# EAGLE design led_matrix_cc (EAGLE 6.2)
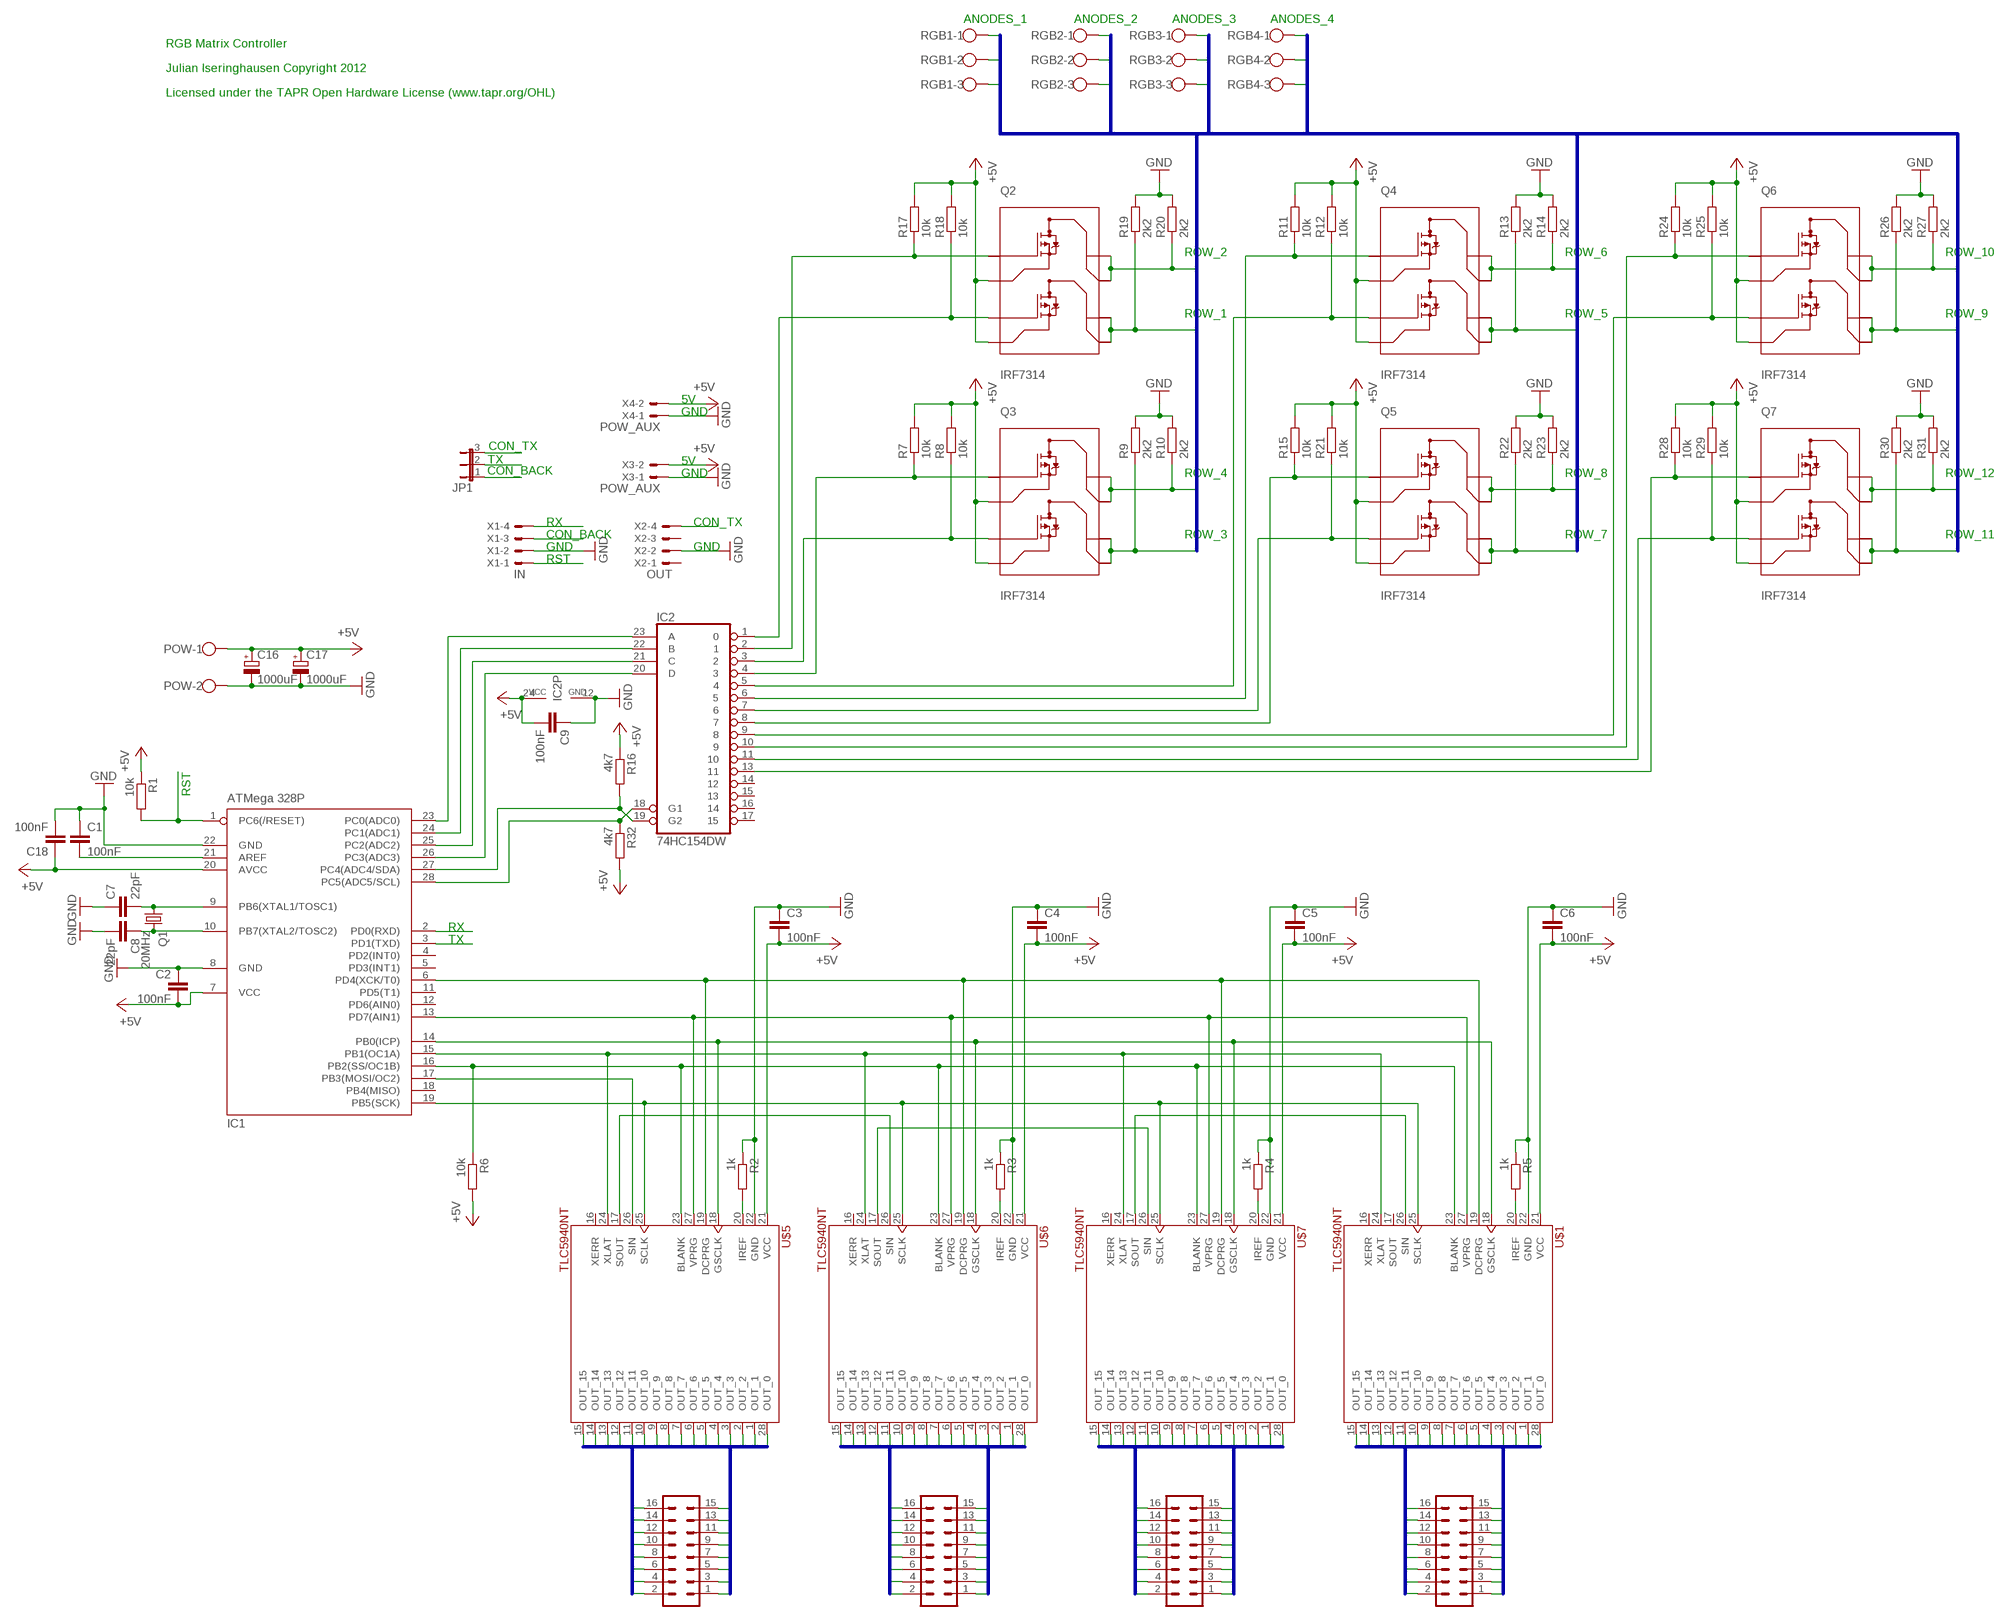
[diagram p0: schematic, sheet 1]

## Parts
C1  100nF  C-EUC1206  [C1206]
C2  100nF  C-EUC1206  [C1206]
C3  100nF  C-EUC1206  [C1206]
C4  100nF  C-EUC1206  [C1206]
C5  100nF  C-EUC1206  [C1206]
C6  100nF  C-EUC1206  [C1206]
C7  22pF  C-EUC1206  [C1206]
C8  22pF  C-EUC1206  [C1206]
C9  100nF  C-EUC1206  [C1206]
C16  1000uF  CPOL-EUE5-10.5  [E5-10,5]
C17  1000uF  CPOL-EUE5-10.5  [E5-10,5]
C18  100nF  C-EUC1206  [C1206]
CON_TLC_1  ML16  [ML16]
CON_TLC_2  ML16  [ML16]
CON_TLC_3  ML16  [ML16]
CON_TLC_4  ML16  [ML16]
IC1  ATMega 328P  MEGA8-P  [DIL28-3]
IC2  74HC154DW  [SO24W]
JP1  JP2E  [JP2]
POW  W237-102  [W237-102]
Q1  20MHz  CRYSTALHC49U70  [HC49U70]
Q2  IRF7314  TRANSISTOR-FET-MOD_IRF7389  [TRANSISTOR-FET-MOD_SO08-IRF]
Q3  IRF7314  TRANSISTOR-FET-MOD_IRF7389  [TRANSISTOR-FET-MOD_SO08-IRF]
Q4  IRF7314  TRANSISTOR-FET-MOD_IRF7389  [TRANSISTOR-FET-MOD_SO08-IRF]
Q5  IRF7314  TRANSISTOR-FET-MOD_IRF7389  [TRANSISTOR-FET-MOD_SO08-IRF]
Q6  IRF7314  TRANSISTOR-FET-MOD_IRF7389  [TRANSISTOR-FET-MOD_SO08-IRF]
Q7  IRF7314  TRANSISTOR-FET-MOD_IRF7389  [TRANSISTOR-FET-MOD_SO08-IRF]
R1  10k  R-EU_R1206  [R1206]
R2  1k  R-EU_R1206  [R1206]
R3  1k  R-EU_R1206  [R1206]
R4  1k  R-EU_R1206  [R1206]
R5  1k  R-EU_R1206  [R1206]
R6  10k  R-EU_R1206  [R1206]
R7  10k  RCL_R-EU_R1206  [RCL_R1206]
R8  10k  RCL_R-EU_R1206  [RCL_R1206]
R9  2k2  RCL_R-EU_R1206  [RCL_R1206]
R10  2k2  RCL_R-EU_R1206  [RCL_R1206]
R11  10k  RCL_R-EU_R1206  [RCL_R1206]
R12  10k  RCL_R-EU_R1206  [RCL_R1206]
R13  2k2  RCL_R-EU_R1206  [RCL_R1206]
R14  2k2  RCL_R-EU_R1206  [RCL_R1206]
R15  10k  RCL_R-EU_R1206  [RCL_R1206]
R16  4k7  R-EU_R1206  [R1206]
R17  10k  RCL_R-EU_R1206  [RCL_R1206]
R18  10k  RCL_R-EU_R1206  [RCL_R1206]
R19  2k2  RCL_R-EU_R1206  [RCL_R1206]
R20  2k2  RCL_R-EU_R1206  [RCL_R1206]
R21  10k  RCL_R-EU_R1206  [RCL_R1206]
R22  2k2  RCL_R-EU_R1206  [RCL_R1206]
R23  2k2  RCL_R-EU_R1206  [RCL_R1206]
R24  10k  RCL_R-EU_R1206  [RCL_R1206]
R25  10k  RCL_R-EU_R1206  [RCL_R1206]
R26  2k2  RCL_R-EU_R1206  [RCL_R1206]
R27  2k2  RCL_R-EU_R1206  [RCL_R1206]
R28  10k  RCL_R-EU_R1206  [RCL_R1206]
R29  10k  RCL_R-EU_R1206  [RCL_R1206]
R30  2k2  RCL_R-EU_R1206  [RCL_R1206]
R31  2k2  RCL_R-EU_R1206  [RCL_R1206]
R32  4k7  R-EU_R1206  [R1206]
RGB1  W237-103  [W237-103]
RGB2  W237-103  [W237-103]
RGB3  W237-103  [W237-103]
RGB4  W237-103  [W237-103]
U$1  TLC5940NT  TLC5940_TLC5940NT  [TLC5940_DIP-28]
U$5  TLC5940NT  TLC5940_TLC5940NT  [TLC5940_DIP-28]
U$6  TLC5940NT  TLC5940_TLC5940NT  [TLC5940_DIP-28]
U$7  TLC5940NT  TLC5940_TLC5940NT  [TLC5940_DIP-28]
X1  IN  22-23-2041  [22-23-2041]
X2  OUT  22-23-2041  [22-23-2041]
X3  POW_AUX  22-23-2021  [22-23-2021]
X4  POW_AUX  22-23-2021  [22-23-2021]

## Nets
+5V: C2.2 C3.2 C4.2 C5.2 C6.2 C9.2 C16.+ C17.+ C18.1 IC1.7(VCC) IC1.20(AVCC) IC2.24(VCC) POW.1 Q2.1(S1) Q2.3(S2) Q3.1(S1) Q3.3(S2) Q4.1(S1) Q4.3(S2) Q5.1(S1) Q5.3(S2) Q6.1(S1) Q6.3(S2) Q7.1(S1) Q7.3(S2) R1.1 R6.2 R7.2 R8.2 R11.2 R12.2 R15.2 R16.1 R17.2 R18.2 R21.2 R24.2 R25.2 R28.2 R29.2 R32.2 U$1.21(VCC) U$5.21(VCC) U$6.21(VCC) U$7.21(VCC) X3.2 X4.2
CON_BACK: JP1.1 X1.3
CON_TX: JP1.3 X2.4
GND: C1.1 C2.1 C3.1 C4.1 C5.1 C6.1 C7.1 C8.2 C9.1 C16.- C17.- C18.2 IC1.8(GND) IC1.22(GND) IC2.12(GND) POW.2 R2.1 R3.1 R4.1 R5.1 R9.2 R10.2 R13.2 R14.2 R19.2 R20.2 R22.2 R23.2 R26.2 R27.2 R30.2 R31.2 U$1.22(GND) U$5.22(GND) U$6.22(GND) U$7.22(GND) X1.2 X2.2 X3.1 X4.1
N$1: IC2.6 Q4.2(G1) R11.1
N$2: IC2.5 Q4.4(G2) R12.1
N$3: IC1.17(PB3(MOSI/OC2)) U$5.26(SIN)
N$4: U$5.17(SOUT) U$6.26(SIN)
N$5: U$6.17(SOUT) U$7.26(SIN)
N$6: IC1.19(PB5(SCK)) U$1.25(SCLK) U$5.25(SCLK) U$6.25(SCLK) U$7.25(SCLK)
N$7: IC1.16(PB2(SS/OC1B)) R6.1 U$1.23(BLANK) U$5.23(BLANK) U$6.23(BLANK) U$7.23(BLANK)
N$8: C7.2 IC1.9(PB6(XTAL1/TOSC1)) Q1.1
N$9: IC1.23(PC0(ADC0)) IC2.23(A)
N$10: IC1.24(PC1(ADC1)) IC2.22(B)
N$11: IC1.25(PC2(ADC2)) IC2.21(C)
N$12: IC1.26(PC3(ADC3)) IC2.20(D)
N$13: IC1.15(PB1(OC1A)) U$1.24(XLAT) U$5.24(XLAT) U$6.24(XLAT) U$7.24(XLAT)
N$14: IC1.6(PD4(XCK/T0)) U$1.19(DCPRG) U$5.19(DCPRG) U$6.19(DCPRG) U$7.19(DCPRG)
N$15: IC1.13(PD7(AIN1)) U$1.27(VPRG) U$5.27(VPRG) U$6.27(VPRG) U$7.27(VPRG)
N$16: IC1.14(PB0(ICP)) U$1.18(GSCLK) U$5.18(GSCLK) U$6.18(GSCLK) U$7.18(GSCLK)
N$17: U$1.26(SIN) U$7.17(SOUT)
N$18: R4.2 U$7.20(IREF)
N$19: IC1.28(PC5(ADC5/SCL)) IC2.18(G1) R32.1
N$20: IC2.9 Q6.4(G2) R25.1
N$21: R5.2 U$1.20(IREF)
N$22: IC2.8 Q5.2(G1) R15.1
N$24: IC2.10 Q6.2(G1) R24.1
N$25: R3.2 U$6.20(IREF)
N$27: R2.2 U$5.20(IREF)
N$29: IC2.13 Q7.2(G1) R28.1
N$31: C8.1 IC1.10(PB7(XTAL2/TOSC2)) Q1.2
N$32: IC2.1 Q2.4(G2) R18.1
N$33: IC2.2 Q2.2(G1) R17.1
N$34: IC2.4 Q3.2(G1) R7.1
N$35: IC2.3 Q3.4(G2) R8.1
N$36: IC2.11 Q7.4(G2) R29.1
N$37: IC2.7 Q5.4(G2) R21.1
N$38: C1.2 IC1.21(AREF)
N$39: IC1.27(PC4(ADC4/SDA)) IC2.19(G2) R16.2
ROW1: Q2.5(D2B) Q2.6(D2A) R19.1 RGB1.1
ROW2: Q2.7(D1B) Q2.8(D1A) R20.1 RGB1.2
ROW3: Q3.5(D2B) Q3.6(D2A) R9.1 RGB1.3
ROW4: Q3.7(D1B) Q3.8(D1A) R10.1 RGB2.1
ROW5: Q4.5(D2B) Q4.6(D2A) R13.1 RGB2.2
ROW6: Q4.7(D1B) Q4.8(D1A) R14.1 RGB2.3
ROW7: Q5.5(D2B) Q5.6(D2A) R22.1 RGB3.1
ROW8: Q5.7(D1B) Q5.8(D1A) R23.1 RGB3.2
ROW9: Q6.5(D2B) Q6.6(D2A) R26.1 RGB3.3
ROW10: Q6.7(D1B) Q6.8(D1A) R27.1 RGB4.1
ROW11: Q7.5(D2B) Q7.6(D2A) R30.1 RGB4.2
ROW12: Q7.7(D1B) Q7.8(D1A) R31.1 RGB4.3
RST: IC1.1(PC6(/RESET)) R1.2 X1.1
RX: IC1.2(PD0(RXD)) X1.4
T1_1: CON_TLC_1.1 U$5.28(OUT_0)
T1_2: CON_TLC_1.2 U$5.1(OUT_1)
T1_3: CON_TLC_1.3 U$5.2(OUT_2)
T1_4: CON_TLC_1.4 U$5.3(OUT_3)
T1_5: CON_TLC_1.5 U$5.4(OUT_4)
T1_6: CON_TLC_1.6 U$5.5(OUT_5)
T1_7: CON_TLC_1.7 U$5.6(OUT_6)
T1_8: CON_TLC_1.8 U$5.7(OUT_7)
T1_9: CON_TLC_1.9 U$5.8(OUT_8)
T1_10: CON_TLC_1.10 U$5.9(OUT_9)
T1_11: CON_TLC_1.11 U$5.10(OUT_10)
T1_12: CON_TLC_1.12 U$5.11(OUT_11)
T1_13: CON_TLC_1.13 U$5.12(OUT_12)
T1_14: CON_TLC_1.14 U$5.13(OUT_13)
T1_15: CON_TLC_1.15 U$5.14(OUT_14)
T1_16: CON_TLC_1.16 U$5.15(OUT_15)
T2_1: CON_TLC_2.1 U$6.28(OUT_0)
T2_2: CON_TLC_2.2 U$6.1(OUT_1)
T2_3: CON_TLC_2.3 U$6.2(OUT_2)
T2_4: CON_TLC_2.4 U$6.3(OUT_3)
T2_5: CON_TLC_2.5 U$6.4(OUT_4)
T2_6: CON_TLC_2.6 U$6.5(OUT_5)
T2_7: CON_TLC_2.7 U$6.6(OUT_6)
T2_8: CON_TLC_2.8 U$6.7(OUT_7)
T2_9: CON_TLC_2.9 U$6.8(OUT_8)
T2_10: CON_TLC_2.10 U$6.9(OUT_9)
T2_11: CON_TLC_2.11 U$6.10(OUT_10)
T2_12: CON_TLC_2.12 U$6.11(OUT_11)
T2_13: CON_TLC_2.13 U$6.12(OUT_12)
T2_14: CON_TLC_2.14 U$6.13(OUT_13)
T2_15: CON_TLC_2.15 U$6.14(OUT_14)
T2_16: CON_TLC_2.16 U$6.15(OUT_15)
T3_1: CON_TLC_3.1 U$7.28(OUT_0)
T3_2: CON_TLC_3.2 U$7.1(OUT_1)
T3_3: CON_TLC_3.3 U$7.2(OUT_2)
T3_4: CON_TLC_3.4 U$7.3(OUT_3)
T3_5: CON_TLC_3.5 U$7.4(OUT_4)
T3_6: CON_TLC_3.6 U$7.5(OUT_5)
T3_7: CON_TLC_3.7 U$7.6(OUT_6)
T3_8: CON_TLC_3.8 U$7.7(OUT_7)
T3_9: CON_TLC_3.9 U$7.8(OUT_8)
T3_10: CON_TLC_3.10 U$7.9(OUT_9)
T3_11: CON_TLC_3.11 U$7.10(OUT_10)
T3_12: CON_TLC_3.12 U$7.11(OUT_11)
T3_13: CON_TLC_3.13 U$7.12(OUT_12)
T3_14: CON_TLC_3.14 U$7.13(OUT_13)
T3_15: CON_TLC_3.15 U$7.14(OUT_14)
T3_16: CON_TLC_3.16 U$7.15(OUT_15)
T4_1: CON_TLC_4.1 U$1.28(OUT_0)
T4_2: CON_TLC_4.2 U$1.1(OUT_1)
T4_3: CON_TLC_4.3 U$1.2(OUT_2)
T4_4: CON_TLC_4.4 U$1.3(OUT_3)
T4_5: CON_TLC_4.5 U$1.4(OUT_4)
T4_6: CON_TLC_4.6 U$1.5(OUT_5)
T4_7: CON_TLC_4.7 U$1.6(OUT_6)
T4_8: CON_TLC_4.8 U$1.7(OUT_7)
T4_9: CON_TLC_4.9 U$1.8(OUT_8)
T4_10: CON_TLC_4.10 U$1.9(OUT_9)
T4_11: CON_TLC_4.11 U$1.10(OUT_10)
T4_12: CON_TLC_4.12 U$1.11(OUT_11)
T4_13: CON_TLC_4.13 U$1.12(OUT_12)
T4_14: CON_TLC_4.14 U$1.13(OUT_13)
T4_15: CON_TLC_4.15 U$1.14(OUT_14)
T4_16: CON_TLC_4.16 U$1.15(OUT_15)
TX: IC1.3(PD1(TXD)) JP1.2
Unconnected: IC1.4(PD2(INT0)) IC1.5(PD3(INT1)) IC1.11(PD5(T1)) IC1.12(PD6(AIN0)) IC1.18(PB4(MISO)) IC2.14 IC2.15 IC2.16 IC2.17 U$1.16(XERR) U$1.17(SOUT) U$5.16(XERR) U$6.16(XERR) U$7.16(XERR) X2.1 X2.3

## Buses
BUS_T1:T1_[1..16]
BUS_T2:T2_[1..16]
BUS_T3:T3_[1..16]
BUS_T4:T4_[1..16]
BUS_ROWS:ROW[1..12]

## Notes on the sheet
- ANODES_1 | ANODES_2 | ANODES_3 | ANODES_4
- RGB Matrix Controller
- Julian Iseringhausen Copyright 2012
- Licensed under the TAPR Open Hardware License (www.tapr.org/OHL)
- ROW_2 | ROW_6 | ROW_10
- ROW_1 | ROW_5 | ROW_9
- 5V
- GND
- CON_TX
- TX | 5V
- CON_BACK | GND | ROW_4 | ROW_8 | ROW_12
- RX | CON_TX
- CON_BACK | ROW_3 | ROW_7 | ROW_11
- GND | GND
- RST
- RST
- RX
- TX

## Library data of the parts
C1-C9 C18 = rcl:C-EU: CAPACITOR, European symbol
C16 C17 = rcl:CPOL-EU: POLARIZED CAPACITOR, European symbol
CON_TLC_1-CON_TLC_4 = con-harting-ml:ML16: HARTING; OC_FARNELL: unknown; OC_NEWARK: unknown
IC1 = atmel:MEGA8-P: MICROCONTROLLER 8 Kbytes FLASH, 1 kbytes SRAM, 512 bytes EEPROM, USART, 4-channel 10 bit ADC, 2-channel 8 bit ADC Pin compatible with Atmega48, ATMega88, ATMega168 Source: avr.lbr; OC_FARNELL: unknown; OC_NEWARK: unknown
IC2 = 74xx-eu:74*154: 4-line to 16-line data SELECTOR/MULTIPLEXER
JP1 = jumper:JP2E: JUMPER
POW = con-wago-500:W237-102: WAGO SCREW CLAMP; MPN: 237-102; OC_FARNELL: unknown; OC_NEWARK: 70K9898
Q1 = crystal:CRYSTAL: CRYSTAL; OC_FARNELL: unknown; OC_NEWARK: unknown
Q2-Q7 = TLC_5940_16x8:TRANSISTOR-FET-MOD_IRF7389: Complimentary Half Bridge HEXFET Power MOSFET Source: http://www.irf.com/product-info/datasheets/data/irf7389.pdf
R1-R6 R16 R32 = rcl:R-EU_: RESISTOR, European symbol
R7-R15 R17-R31 = TLC_5940_16x8:RCL_R-EU_: RESISTOR, European symbol
RGB1-RGB4 = con-wago-500:W237-103: WAGO SCREW CLAMP; MPN: 237-103; OC_FARNELL: unknown; OC_NEWARK: 18M7116
U$1 U$5-U$7 = TLC_5940_16x8:TLC5940_TLC5940
X1 X2 = con-molex:22-23-2041: .100" (2.54mm) Center Header - 4 Pin; MF: MOLEX; MPN: 22-23-2041; OC_FARNELL: 1462920; OC_NEWARK: 38C0355
X3 X4 = con-molex:22-23-2021: .100" (2.54mm) Center Header - 2 Pin; MF: MOLEX; MPN: 22-23-2021; OC_FARNELL: 1462926; OC_NEWARK: 25C3832

## Board
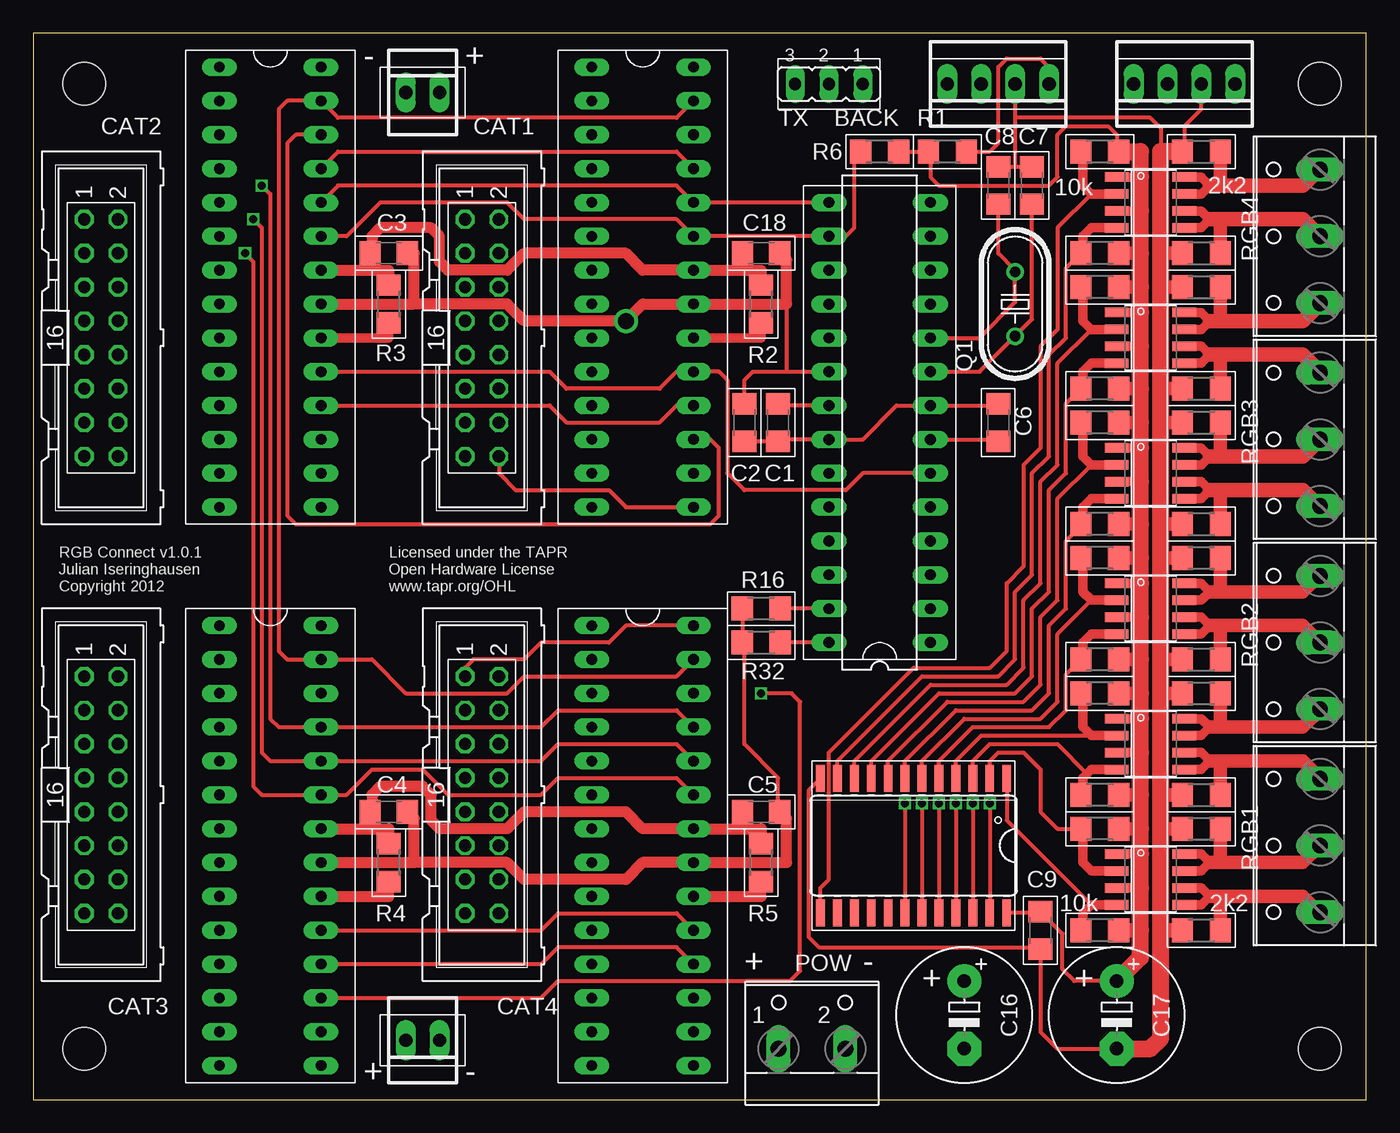
[diagram p1: board, top side]
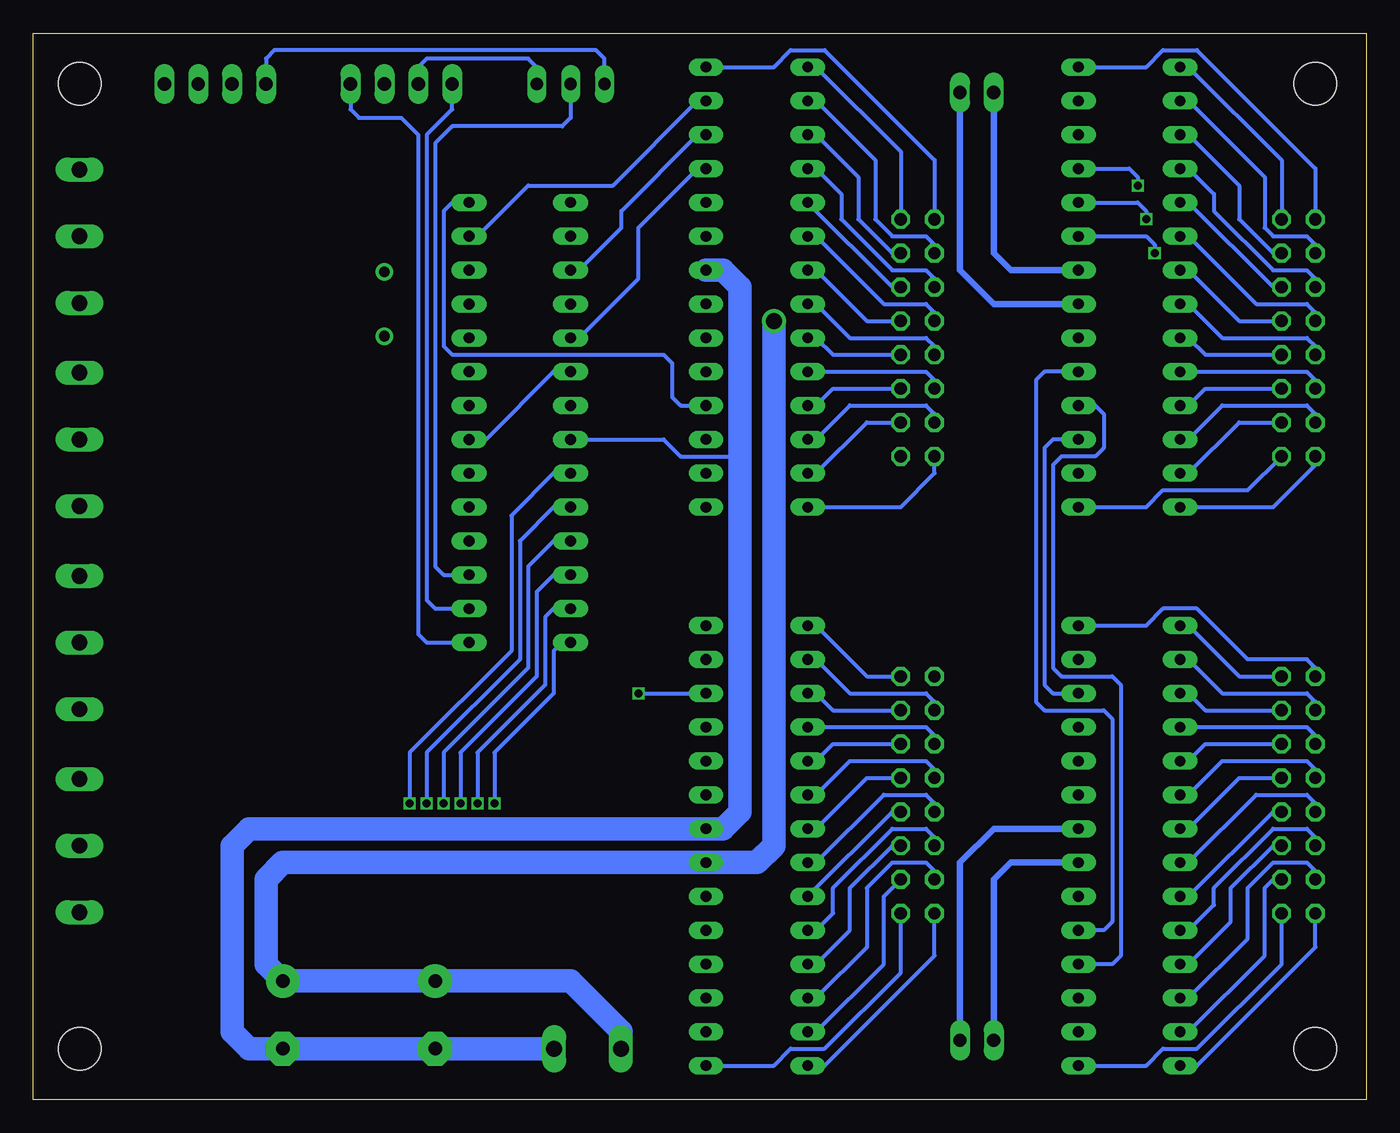
[diagram p2: board, bottom side, seen from below]

Size 100 x 80 mm. Coordinates in mm from the lower left corner, seen from the top.
Outline: 0,0 100,0 100,80 0,80 0,0
Copper layers (1*16): Top 0.035mm / dielectric 1.5mm / Bottom 0.035mm
Design rules: minimum track width 6mil, minimum drill 12mil, track to track 6mil, track to pad 6mil, pad to pad 6mil, via to via 6mil, smd to smd 0mil, copper to edge 10mil, drill to drill 10mil, minimum pad ring 10mil, minimum via ring 6mil, stop-mask expansion 2mil, vias tented up to drill 100mil, thermal gap 10mil
Holes 3.2 mm at 3.81,76.2 3.81,3.81 96.52,3.81 96.52,76.2

### Footprints (pad centres in the part's own frame; a part is rotated, then mirrored left to right if it is on the bottom)
C1206 = smd 1.6 x 1.8: 1 -1.4,0; 2 1.4,0
E5-10,5 = drill 1.016 pad 2.54: + -2.54,0 | drill 1.016 pad 2.54 octagon: - 2.54,0
ML16 = drill 0.914 octagon: 1 -8.89,-1.27; 2 -8.89,1.27; 3 -6.35,-1.27; 4 -6.35,1.27; 5 -3.81,-1.27; 6 -3.81,1.27; 7 -1.27,-1.27; 8 -1.27,1.27; 9 1.27,-1.27; 10 1.27,1.27; 11 3.81,-1.27; 12 3.81,1.27; 13 6.35,-1.27; 14 6.35,1.27; 15 8.89,-1.27; 16 8.89,1.27
DIL28-3 = drill 0.813 long: 1 -16.51,-3.81; 2 -13.97,-3.81; 3 -11.43,-3.81; 4 -8.89,-3.81; 5 -6.35,-3.81; 6 -3.81,-3.81; 7 -1.27,-3.81; 8 1.27,-3.81; 9 3.81,-3.81; 10 6.35,-3.81; 11 8.89,-3.81; 12 11.43,-3.81; 13 13.97,-3.81; 14 16.51,-3.81; 15 16.51,3.81; 16 13.97,3.81; 17 11.43,3.81; 18 8.89,3.81; 19 6.35,3.81; 20 3.81,3.81; 21 1.27,3.81; 22 -1.27,3.81; 23 -3.81,3.81; 24 -6.35,3.81; 25 -8.89,3.81; 26 -11.43,3.81; 27 -13.97,3.81; 28 -16.51,3.81
SO24W = smd 0.66 x 2.032: 1 -6.985,-5.029; 2 -5.715,-5.029; 3 -4.445,-5.029; 4 -3.175,-5.029; 5 -1.905,-5.029; 6 -0.635,-5.029; 7 0.635,-5.029; 8 1.905,-5.029; 9 3.175,-5.029; 10 4.445,-5.029; 11 5.715,-5.029; 12 6.985,-5.029; 13 6.985,5.029; 14 5.715,5.029; 15 4.445,5.029; 16 3.175,5.029; 17 1.905,5.029; 18 0.635,5.029; 19 -0.635,5.029; 20 -1.905,5.029; 21 -3.175,5.029; 22 -4.445,5.029; 23 -5.715,5.029; 24 -6.985,5.029
JP2 = drill 0.914 long: 1 -2.54,0; 2 0,0; 3 2.54,0
W237-102 = drill 1.194 long: 1 -2.5,-1.27; 2 2.5,-1.27
HC49U70 = drill 0.813: 1 -2.413,0; 2 2.413,0
TRANSISTOR-FET-MOD_SO08-IRF = smd 0.72 x 1.78: 1 -1.905,-2.543; 2 -0.635,-2.543; 3 0.635,-2.543; 4 1.905,-2.543; 5 1.905,2.543; 6 0.635,2.543; 7 -0.635,2.543; 8 -1.905,2.543
R1206 = smd 1.6 x 1.803: 1 -1.422,0; 2 1.422,0
RCL_R1206 = smd 1.6 x 1.803: 1 -1.422,0; 2 1.422,0
W237-103 = drill 1.194 long: 1 -5,-1.29; 2 0,-1.29; 3 5,-1.29
TLC5940_DIP-28 = drill 0.8 long: 1 -3.81,-1.27; 2 -3.81,-3.81; 3 -3.81,-6.35; 4 -3.81,-8.89; 5 -3.81,-11.43; 6 -3.81,-13.97; 7 -3.81,-16.51; 8 -3.81,-19.05; 9 -3.81,-21.59; 10 -3.81,-24.13; 11 -3.81,-26.67; 12 -3.81,-29.21; 13 -3.81,-31.75; 14 -3.81,-34.29; 15 3.81,-34.29; 16 3.81,-31.75; 17 3.81,-29.21; 18 3.81,-26.67; 19 3.81,-24.13; 20 3.81,-21.59; 21 3.81,-19.05; 22 3.81,-16.51; 23 3.81,-13.97; 24 3.81,-11.43; 25 3.81,-8.89; 26 3.81,-6.35; 27 3.81,-3.81; 28 3.81,-1.27
22-23-2041 = drill 1 long: 1 -3.81,0; 2 -1.27,0; 3 1.27,0; 4 3.81,0
22-23-2021 = drill 1 long: 1 -1.27,0; 2 1.27,0

### Placement (x,y rotation side)
C1  55.88,50.8 90 top
C2  53.34,50.8 90 top
C3  26.67,63.5 0 top
C4  26.67,21.59 0 top
C5  54.61,21.59 0 top
C6  72.39,50.8 270 top
C7  74.93,68.58 270 top
C8  72.39,68.58 90 top
C9  75.56,12.7 90 top
C16  69.85,6.35 270 top
C17  81.28,6.35 270 top
C18  54.61,63.5 180 top
CON_TLC_1  33.66,57.15 270 top
CON_TLC_2  5.08,57.15 270 top
CON_TLC_3  5.08,22.86 270 top
CON_TLC_4  33.66,22.86 270 top
IC1  63.5,50.8 90 top
IC2  66.04,19.05 180 top
JP1  59.69,76.2 180 top
POW  58.42,5.08 0 top
Q1  73.66,59.69 90 top
Q2  83.82,16.51 270 top
Q3  83.82,26.67 270 top
Q4  83.82,36.83 270 top
Q5  83.82,46.99 270 top
Q6  83.82,57.15 270 top
Q7  83.82,67.31 270 top
R1  68.58,71.12 0 top
R2  54.61,59.69 270 top
R3  26.67,59.69 270 top
R4  26.67,17.78 270 top
R5  54.61,17.78 270 top
R6  63.5,71.12 0 top
R7  80.01,30.48 0 top
R8  80.01,22.86 0 top
R9  87.63,22.86 180 top
R10  87.63,30.48 180 top
R11  80.01,40.64 0 top
R12  80.01,33.02 0 top
R13  87.63,33.02 180 top
R14  87.63,40.64 180 top
R15  80.01,50.8 0 top
R16  54.61,36.83 0 top
R17  80.01,20.32 0 top
R18  80.01,12.7 0 top
R19  87.63,12.7 180 top
R20  87.63,20.32 180 top
R21  80.01,43.18 0 top
R22  87.63,43.18 180 top
R23  87.63,50.8 180 top
R24  80.01,60.96 0 top
R25  80.01,53.34 0 top
R26  87.63,53.34 180 top
R27  87.63,60.96 180 top
R28  80.01,71.12 0 top
R29  80.01,63.5 0 top
R30  87.63,63.5 180 top
R31  87.63,71.12 180 top
R32  54.61,34.29 180 top
RGB1  95.25,19.05 90 top
RGB2  95.25,34.29 90 top
RGB3  95.25,49.53 90 top
RGB4  95.25,64.77 90 top
U$1  45.72,36.83 0 top
U$5  45.72,78.74 0 top
U$6  17.78,78.74 0 top
U$7  17.78,36.83 0 top
X1  72.39,76.2 180 top
X2  86.36,76.2 180 top
X3  29.21,4.45 180 top
X4  29.21,75.56 0 top

### Tracks (layer width: path | path; a pad name or v marks a point on that pad's centre or on a via)
+5V  (via drill 1.2 pad 1.27)
  Top 0.3: IC1.7 72.26,49.53 C6.2 | R16.1 R32.2 53.34,34.14 53.34,26.67 55.88,24.13 55.88,21.59 C5.2 | 56.52,59.69 56.52,54.61 | 56.52,54.61 IC1.20 | C2.2 53.34,53.98 53.98,54.61 56.52,54.61 | R6.2 R1.1 67.31,71.12 67.31,69.22 67.94,68.58 76.2,68.58 76.83,69.22 76.83,72.39 77.47,73.03 80.64,73.03 81.28,72.39 81.28,71.27 R28.2 | IC2.24 75.49,14.02 C9.2 77.22,12.45 77.22,9.78 78.11,8.89 C17.+
  Top 0.7: Q2.1 83.06,18.41 | Q2.3 83.06,15.88 | 28.57,63.5 C3.2 | 28.57,21.09 C4.2 | 56.52,62.99 C18.1
  Top 0.72: Q3.3 83.06,26.04 | Q3.1 83.06,28.57 | Q4.3 83.06,36.2 | Q4.1 83.06,38.73 | Q5.1 83.06,48.9 | Q5.3 83.06,46.35 | Q6.3 83.06,56.52 | Q6.1 83.06,59.05 | Q7.1 83.06,69.22 | Q7.3 83.06,66.67
  Top 0.813: U$6.21 28.57,59.69 | 28.57,59.69 28.57,63.5 | 28.57,59.69 35.56,59.69 36.83,58.42 v44.45,58.42 45.72,59.69 U$5.21 56.52,59.69 56.52,62.99 | U$7.21 28.57,17.78 | 28.57,17.78 28.57,21.09 | C5.2 56.52,21.09 56.52,17.78 U$1.21 45.72,17.78 44.45,16.51 36.83,16.51 35.56,17.78 28.57,17.78
  Top 1: R17.2 83.06,20.32 | R8.2 83.06,22.86 | R7.2 83.06,30.48 | R11.2 83.06,40.64 | R12.2 83.06,33.02 | R21.2 83.06,43.18 | R15.2 83.06,50.8 | R24.2 83.06,60.96 | R25.2 83.06,53.34 | R29.2 83.06,63.5
  Top 1.1: R18.2 83.06,12.7
  Top 1.27: C17.+ 83.06,10.67 83.06,12.7 83.06,15.88 83.06,18.41 83.06,20.32 83.06,22.86 83.06,26.04 83.06,28.57 83.06,30.48 83.06,33.02 83.06,36.2 83.06,38.73 83.06,40.64 83.06,43.18 83.06,46.35 83.06,48.9 83.06,50.8 83.06,53.34 83.06,56.52 83.06,59.05 83.06,60.96 83.06,63.5 83.06,66.67 83.06,69.22 83.06,71.12 R28.2
  Bottom 0.3: IC1.20 60.96,54.61 66.04,49.53 IC1.7
  Bottom 0.5: X3.2 27.94,16.51 26.67,17.78 U$7.21 | X4.2 30.48,62.23 27.94,59.69 U$6.21
  Bottom 1.778: POW.1 55.92,5.12 59.69,8.89 C16.+ C17.+ 82.55,10.16 82.55,16.51 81.28,17.78 U$1.21 45.72,17.78 44.45,19.05 v44.45,58.42
CON_BACK
  Bottom 0.3: JP1.1 62.23,77.47 62.87,78.11 70.48,78.11 71.12,77.47 X1.3
CON_TX
  Bottom 0.3: JP1.3 57.15,78.11 57.78,78.74 81.92,78.74 82.55,78.11 X2.4
GND
  Top 0.3: C8.2 73.66,69.98 | 73.66,69.98 C7.1 | C2.1 C1.1 56.01,49.53 IC1.22 62.23,49.53 64.77,52.07 IC1.8 72.26,52.07 C6.1 | R31.2 86.36,71.27 86.36,73.03 87.63,74.3 X2.2 | X1.2 73.66,73.66 | 73.66,73.66 73.66,69.98 | 73.66,73.66 83.82,73.66 84.58,72.9 84.58,71.25 84.71,71.12 | C17.- 76.83,3.81 75.56,5.08 C9.1 75.44,11.43 58.93,11.43 58.17,12.19 58.17,23.19 IC2.12 58.93,24.21 58.93,24.64
  Top 0.7: 25.4,63.63 C3.1 25.27,62.36 25.4,62.23 | 25.27,20.45 25.4,20.32 | 25.4,21.72 C4.1 | C18.2 53.21,62.36 53.34,62.23
  Top 0.813: 25.4,63.63 25.4,64.77 26.04,65.41 29.84,65.41 30.48,64.77 30.48,62.87 31.11,62.23 35.56,62.23 36.83,63.5 44.45,63.5 45.72,62.23 U$5.22 53.34,62.23 54.61,62.23 R2.1 | U$7.22 25.4,20.32 26.67,20.32 R4.1 | C4.1 25.27,20.45 | 53.34,20.32 U$1.22 45.72,20.32 44.45,21.59 36.83,21.59 35.56,20.32 30.48,20.32 29.84,20.95 29.84,22.86 29.21,23.5 26.04,23.5 25.4,22.86 25.4,21.72 | 53.34,20.32 54.61,20.32 R5.1 | U$6.22 25.4,62.23 26.67,62.23 R3.1 | C5.1 53.21,20.45 53.34,20.32
  Top 1: R20.2 84.58,20.32 | R9.2 84.58,22.86 | R10.2 84.58,30.48 | R13.2 84.58,33.02 | R14.2 84.58,40.64 | R22.2 84.58,43.18 | R23.2 84.58,50.8 | R27.2 84.58,60.96 | R30.2 84.58,63.5 | R26.2 84.58,53.34
  Top 1.1: R19.2 84.58,12.7 | 84.71,71.12 84.58,71.12
  Top 1.27: C17.- 83.82,3.81 84.58,4.57 84.58,12.7 84.58,20.32 84.58,22.86 84.58,30.48 84.58,33.02 84.58,40.64 84.58,43.18 84.58,50.8 84.58,53.34 84.58,60.96 84.58,63.5 84.58,71.12 | R31.2 84.71,71.12
  Bottom 0.3: IC1.22 52.7,49.53 51.44,48.26 46.99,48.26
  Bottom 0.5: X3.1 30.48,17.78 27.94,20.32 U$7.22 | X4.1 27.94,63.5 26.67,62.23 U$6.22
  Bottom 1.778: POW.2 C16.- C17.- 83.82,3.81 85.09,5.08 85.09,19.05 83.82,20.32 U$1.22 48.26,20.32 46.99,21.59 46.99,48.26 46.99,60.96 48.26,62.23 U$5.22
N$1
  Top 0.3: 79.38,37.47 76.83,34.92 76.83,29.84 75.56,28.57 69.85,28.57 66.67,25.4 IC2.6
  Top 0.7: 78.74,40.49 R11.1
  Top 0.72: Q4.2 79.38,37.47 78.74,38.1 78.74,40.49
N$2
  Top 0.3: IC2.5 67.94,25.4 70.48,27.94 76.2,27.94 77.47,29.21 77.47,31.9 R12.1
  Top 0.7: 78.74,33.17 R12.1
  Top 0.72: Q4.4 79.38,34.92 78.74,34.29 78.74,33.17
N$3
  Bottom 0.3: IC1.17 59.05,62.23 55.88,65.41 55.88,66.67 50.16,72.39 U$5.26
N$4
  Top 0.3: U$6.26 19.68,72.39 19.05,71.75 19.05,43.81 19.68,43.18 50.8,43.18 51.44,43.81 51.44,48.9 50.8,49.53 U$5.17
N$5
  Bottom 0.3: U$6.17 23.5,49.53 24.13,48.9 24.13,31.11 23.5,30.48 U$7.26
N$6  (via drill 0.6)
  Top 0.3: U$6.25 22.86,71.12 48.26,71.12 U$5.25 | U$1.25 48.26,29.21 39.37,29.21 38.1,27.94 U$7.25 18.41,27.94 17.78,28.57 17.78,67.94 v17.14,68.58
  Bottom 0.3: IC1.19 59.05,57.15 54.61,61.59 54.61,65.41 50.16,69.85 U$5.25 | U$6.25 17.78,69.85 17.14,69.22 v17.14,68.58
N$7  (via drill 0.6)
  Top 0.3: U$6.23 23.5,64.77 26.04,67.31 35.56,67.31 36.83,66.04 48.26,66.04 U$5.23 IC1.16 60.96,64.77 61.59,65.41 61.59,70.64 R6.1 | U$1.23 48.26,24.13 39.37,24.13 38.1,22.86 31.11,22.86 29.21,24.77 25.4,24.77 23.5,22.86 U$7.23 17.14,22.86 16.51,23.5 16.51,62.87 v15.88,63.5
  Bottom 0.3: U$6.23 16.51,64.77 15.88,64.14 v15.88,63.5
N$8
  Top 0.3: IC1.9 70.99,54.61 Q1.1 74.93,58.55 C7.2
N$9  (via drill 0.6)
  Top 0.3: v71.75,22.23 IC2.23
  Bottom 0.3: IC1.23 60.96,46.99 64.14,43.81 64.14,33.66 71.75,26.04 v71.75,22.23
N$10  (via drill 0.6)
  Top 0.3: v70.48,22.23 IC2.22
  Bottom 0.3: IC1.24 60.96,44.45 63.5,41.91 63.5,33.02 70.48,26.04 v70.48,22.23
N$11  (via drill 0.6)
  Top 0.3: v69.22,22.23 IC2.21
  Bottom 0.3: IC1.25 60.96,41.91 62.87,40.01 62.87,32.38 69.22,26.04 v69.22,22.23
N$12  (via drill 0.6)
  Top 0.3: v67.94,22.23 IC2.20
  Bottom 0.3: IC1.26 60.96,39.37 62.23,38.1 62.23,31.75 67.94,26.04 v67.94,22.23
N$13  (via drill 0.6)
  Top 0.3: IC1.15 U$5.24 48.26,68.58 22.86,68.58 U$6.24 | U$1.24 48.26,26.67 39.37,26.67 38.1,25.4 U$7.24 17.78,25.4 17.14,26.04 17.14,65.41 v16.51,66.04
  Bottom 0.3: U$6.24 17.14,67.31 16.51,66.67 v16.51,66.04
N$14
  Top 0.3: U$6.19 38.73,54.61 40.01,53.34 46.99,53.34 48.26,54.61 U$5.19 51.44,54.61 52.07,53.98 52.07,46.99 53.34,45.72 60.96,45.72 62.23,46.99 IC1.6 | U$7.19 38.1,12.7 39.37,13.97 48.26,13.97 U$1.19
  Bottom 0.3: U$6.19 24.13,54.61 24.77,53.98 24.77,29.84 24.13,29.21 19.68,29.21 19.05,28.57 19.05,13.34 19.68,12.7 U$7.19
N$15
  Top 0.3: U$5.27 48.26,73.66 22.86,73.66 U$6.27 19.05,74.93 18.41,74.3 18.41,33.66 19.05,33.02 U$7.27 25.4,33.02 27.94,30.48 35.56,30.48 36.83,31.75 48.26,31.75 U$1.27
  Bottom 0.3: U$5.27 50.16,74.93 56.52,68.58 62.87,68.58 66.67,64.77 IC1.13
N$16
  Top 0.3: U$6.18 38.73,52.07 40.01,50.8 46.99,50.8 48.26,52.07 U$5.18 | U$1.18 48.26,11.43 39.37,11.43 38.1,10.16 U$7.18
  Bottom 0.3: IC1.14 68.58,67.31 69.22,66.67 69.22,56.52 68.58,55.88 52.7,55.88 52.07,55.24 52.07,52.7 51.44,52.07 U$5.18 | U$6.18 20.32,52.07 19.68,51.44 19.68,48.9 20.32,48.26 22.86,48.26 23.5,47.62 23.5,32.38 22.86,31.75 19.05,31.75 18.41,31.11 18.41,10.79 19.05,10.16 U$7.18
N$17  (via drill 0.6)
  Top 0.3: U$7.17 38.1,7.62 39.37,8.89 56.77,8.89 57.53,9.65 57.53,29.84 56.9,30.48 v54.61,30.48
  Bottom 0.3: v54.61,30.48 U$1.26
N$18
  Top 0.813: U$7.20 26.67,15.24 R4.2
N$19  (via drill 0.6)
  Top 0.3: IC1.28 R32.1 | v65.41,22.23 IC2.18
  Bottom 0.3: v65.41,22.23 65.41,26.04 60.96,30.48 60.96,33.66 60.33,34.29 IC1.28
N$20
  Top 0.3: IC2.9 62.87,25.4 67.94,30.48 73.66,30.48 74.93,31.75 74.93,36.83 76.2,38.1 76.2,45.72 77.47,46.99 77.47,52.22 R25.1
  Top 0.7: 78.74,53.49 R25.1
  Top 0.72: Q6.4 79.38,55.24 78.74,54.61 78.74,53.49
N$21
  Top 0.813: U$1.20 54.61,15.24 R5.2
N$22
  Top 0.3: IC2.8 64.14,25.4 68.58,29.84 74.3,29.84 75.56,31.11 75.56,36.2 76.83,37.47 76.83,45.09 79.38,47.62
  Top 0.7: 78.74,50.65 R15.1
  Top 0.72: Q5.2 79.38,47.62 78.74,48.26 78.74,50.65
N$24
  Top 0.3: 79.38,57.78 76.83,55.24 76.83,47.62 75.56,46.35 75.56,38.73 74.3,37.47 74.3,32.38 73.03,31.11 67.31,31.11 61.59,25.4 IC2.10
  Top 0.7: 78.74,60.81 R24.1
  Top 0.72: Q6.2 79.38,57.78 78.74,58.42 78.74,60.81
N$25
  Top 0.7: U$6.20 26.67,57.15 R3.2
N$27
  Top 0.7: U$5.20 54.61,57.15 R2.2
N$29
  Top 0.3: 79.38,67.94 76.83,65.41 76.83,57.78 75.56,56.52 75.56,48.9 74.3,47.62 74.3,40.01 73.03,38.73 73.03,33.66 71.75,32.38 66.04,32.38 59.69,26.04 59.69,16.51 59.05,15.88 IC2.13
  Top 0.7: 78.74,70.97 R28.1
  Top 0.72: Q7.2 79.38,67.94 78.74,68.58 78.74,70.97
N$31
  Top 0.3: IC1.10 70.99,57.15 73.66,59.82 Q1.2 73.66,62.23 72.39,63.5 C8.1
N$32
  Top 0.3: IC2.1 73.03,20.95 79.38,14.61
  Top 0.7: 78.74,12.85 R18.1
  Top 0.72: Q2.4 79.38,14.61 78.74,13.97 78.74,12.85
N$33
  Top 0.3: IC2.2 71.75,25.4 72.39,26.04 74.3,26.04 75.56,24.77 75.56,21.59 76.83,20.32 R17.1
  Top 0.7: 78.74,20.17 R17.1
  Top 0.72: Q2.2 79.38,17.14 78.74,17.78 78.74,20.17
N$34
  Top 0.3: IC2.4 69.22,25.4 71.12,27.3 79.38,27.3
  Top 0.7: 78.74,30.33 R7.1
  Top 0.72: Q3.2 79.38,27.3 78.74,27.94 78.74,30.33
N$35
  Top 0.3: IC2.3 70.48,25.4 71.75,26.67 76.83,26.67 79.06,24.45
  Top 0.7: 78.74,23.01 R8.1
  Top 0.72: Q3.4 79.38,24.77 79.06,24.45 78.74,24.13 78.74,23.01
N$36
  Top 0.3: R29.1 77.47,62.38 77.47,57.15 76.2,55.88 76.2,48.26 74.93,46.99 74.93,39.37 73.66,38.1 73.66,33.02 72.39,31.75 66.67,31.75 60.33,25.4 IC2.11
  Top 0.7: 78.74,63.65 R29.1
  Top 0.72: Q7.4 79.38,65.41 78.74,64.77 78.74,63.65
N$37
  Top 0.3: R21.1 78.59,43.03 77.47,41.91 77.47,36.83 76.2,35.56 76.2,30.48 74.93,29.21 69.22,29.21 65.41,25.4 IC2.7
  Top 0.7: 78.74,43.33 R21.1
  Top 0.72: Q5.4 79.38,45.09 78.74,44.45 78.74,43.33
N$38
  Top 0.3: IC1.21 56.01,52.07 C1.2
N$39  (via drill 0.6)
  Top 0.3: IC1.27 R16.2 | v66.67,22.23 IC2.19
  Bottom 0.3: IC1.27 60.96,36.83 61.59,36.2 61.59,31.11 66.67,26.04 v66.67,22.23
ROW1
  Top 0.72: Q2.5 87.63,14.61 88.27,15.24 87.63,15.88 Q2.6
  Top 1: RGB1.1 96.44,14.05 95.25,15.24 88.9,15.24 | 88.9,15.24 88.27,15.24 | R19.1 89.05,15.09 88.9,15.24
ROW2
  Top 0.72: Q2.7 87.63,17.14 88.27,17.78 87.63,18.41 Q2.8
  Top 1: RGB1.2 96.52,19.05 95.25,17.78 88.9,17.78 | 88.9,17.78 88.27,17.78 | R20.1 89.05,17.93 88.9,17.78
ROW3
  Top 0.72: Q3.6 87.63,26.04 88.27,25.4 87.63,24.77 Q3.5
  Top 1: RGB1.3 96.54,24.11 95.25,25.4 88.9,25.4 | 88.9,25.4 88.27,25.4 | R9.1 89.05,25.25 88.9,25.4
ROW4
  Top 0.72: Q3.7 87.63,27.3 88.27,27.94 87.63,28.57 Q3.8
  Top 1: RGB2.1 96.54,29.23 95.25,27.94 88.9,27.94 | 88.9,27.94 88.27,27.94 | R10.1 89.05,28.09 88.9,27.94
ROW5
  Top 0.72: Q4.6 87.63,36.2 88.27,35.56 87.63,34.92 Q4.5
  Top 1: RGB2.2 96.52,34.29 95.25,35.56 88.9,35.56 | 88.9,35.56 88.27,35.56 | R13.1 89.05,35.41 88.9,35.56
ROW6
  Top 0.72: Q4.7 87.63,37.47 88.27,38.1 87.63,38.73 Q4.8
  Top 1: RGB2.3 96.44,39.29 95.25,38.1 88.9,38.1 | 88.9,38.1 88.27,38.1 | R14.1 89.05,38.25 88.9,38.1
ROW7
  Top 0.72: Q5.6 87.63,46.35 88.27,45.72 87.63,45.09 Q5.5
  Top 1: RGB3.1 96.44,44.53 | R22.1 89.05,45.57 88.9,45.72
  Top 1.1: 96.44,44.53 95.25,45.72 88.9,45.72 88.27,45.72
ROW8
  Top 0.72: Q5.7 87.63,47.62 88.27,48.26 87.63,48.9 Q5.8
  Top 1: RGB3.2 96.52,49.53 | R23.1 89.05,48.41 88.9,48.26
  Top 1.1: 96.52,49.53 95.25,48.26 88.9,48.26 88.27,48.26
ROW9
  Top 0.72: Q6.5 87.63,55.24 88.27,55.88 87.63,56.52 Q6.6
  Top 1: RGB3.3 96.54,54.59 | R26.1 89.05,55.73 88.9,55.88
  Top 1.1: 96.54,54.59 95.25,55.88 88.9,55.88 88.27,55.88
ROW10
  Top 0.72: Q6.7 87.63,57.78 88.27,58.42 87.63,59.05 Q6.8
  Top 1: R27.1 89.05,58.57 88.9,58.42 | RGB4.1 96.54,59.71
  Top 1.1: 88.27,58.42 88.9,58.42 95.25,58.42 96.54,59.71
ROW11
  Top 0.72: Q7.6 87.63,66.67 88.27,66.04 87.63,65.41 Q7.5
  Top 1: RGB4.2 96.52,64.77 | R30.1 89.05,65.89 88.9,66.04
  Top 1.1: 96.52,64.77 95.25,66.04 88.9,66.04 88.27,66.04
ROW12
  Top 0.72: Q7.7 87.63,67.94 88.27,68.58 87.63,69.22 Q7.8
  Top 1: RGB4.3 96.44,69.77 | R31.1 89.05,68.73 88.9,68.58
  Top 1.1: 96.44,69.77 95.25,68.58 88.9,68.58 88.27,68.58
RST
  Top 0.3: R1.2 71.75,71.12 72.39,71.75 72.39,77.47 73.03,78.11 75.56,78.11 76.2,77.47 X1.1
  Bottom 0.3: X1.1 76.2,74.3 75.56,73.66 72.39,73.66 71.12,72.39 71.12,34.92 70.48,34.29 IC1.1
RX
  Bottom 0.3: IC1.2 69.85,36.83 70.48,37.47 70.48,72.39 68.58,74.3 X1.4
T1_1
  Bottom 0.3: U$5.28 44.45,77.47 43.18,78.74 40.64,78.74 32.38,70.48 CON_TLC_1.1
T1_2
  Bottom 0.3: U$5.1 41.27,77.47 34.92,71.12 CON_TLC_1.2
T1_3
  Bottom 0.3: U$5.2 41.27,74.93 36.83,70.48 36.83,66.04 35.56,64.77 33.02,64.77 32.38,64.14 CON_TLC_1.3
T1_4
  Bottom 0.3: U$5.3 41.27,72.39 38.1,69.22 38.1,66.04 35.56,63.5 CON_TLC_1.4
T1_5
  Bottom 0.3: U$5.4 41.27,69.85 39.37,67.94 39.37,66.04 35.56,62.23 33.02,62.23 32.38,61.59 CON_TLC_1.5
T1_6
  Bottom 0.3: U$5.5 35.56,60.96 CON_TLC_1.6
T1_7
  Bottom 0.3: U$5.6 41.27,64.77 36.2,59.69 33.02,59.69 32.38,59.05 CON_TLC_1.7
T1_8
  Bottom 0.3: U$5.7 41.27,62.23 37.47,58.42 CON_TLC_1.8
T1_9
  Bottom 0.3: U$5.8 41.27,59.69 38.73,57.15 33.02,57.15 32.38,56.52 CON_TLC_1.9
T1_10
  Bottom 0.3: U$5.9 41.27,57.15 40.01,55.88 CON_TLC_1.10
T1_11
  Bottom 0.3: U$5.10 33.02,54.61 32.38,53.98 CON_TLC_1.11
T1_12
  Bottom 0.3: U$5.11 41.27,52.07 40.01,53.34 CON_TLC_1.12
T1_13
  Bottom 0.3: U$5.12 41.27,49.53 38.73,52.07 33.02,52.07 32.38,51.44 CON_TLC_1.13
T1_14
  Bottom 0.3: U$5.13 41.27,46.99 37.47,50.8 CON_TLC_1.14
T1_15
  Bottom 0.3: U$5.14 34.92,44.45 32.38,46.99 CON_TLC_1.15
T1_16
  Top 0.3: CON_TLC_1.16 34.92,46.99 36.2,45.72 43.18,45.72 44.45,44.45 U$5.15
T2_1
  Bottom 0.3: CON_TLC_2.1 3.81,69.85 12.7,78.74 15.24,78.74 16.51,77.47 U$6.28
T2_2
  Bottom 0.3: U$6.1 13.34,77.47 6.35,70.48 CON_TLC_2.2
T2_3
  Bottom 0.3: U$6.2 13.34,74.93 7.62,69.22 7.62,65.41 6.99,64.77 4.45,64.77 3.81,64.14 CON_TLC_2.3
T2_4
  Bottom 0.3: U$6.3 13.34,72.39 9.53,68.58 9.53,66.04 6.99,63.5 CON_TLC_2.4
T2_5
  Bottom 0.3: U$6.4 13.34,69.85 11.43,67.94 11.43,66.67 6.99,62.23 4.45,62.23 3.81,61.59 CON_TLC_2.5
T2_6
  Bottom 0.3: U$6.5 13.34,67.31 6.99,60.96 CON_TLC_2.6
T2_7
  Bottom 0.3: U$6.6 13.34,64.77 8.26,59.69 4.45,59.69 3.81,59.05 CON_TLC_2.7
T2_8
  Bottom 0.3: U$6.7 13.34,62.23 9.53,58.42 CON_TLC_2.8
T2_9
  Bottom 0.3: U$6.8 13.34,59.69 10.79,57.15 4.45,57.15 3.81,56.52 CON_TLC_2.9
T2_10
  Bottom 0.3: U$6.9 13.34,57.15 12.06,55.88 CON_TLC_2.10
T2_11
  Bottom 0.3: U$6.10 4.45,54.61 3.81,53.98 CON_TLC_2.11
T2_12
  Bottom 0.3: U$6.11 13.34,52.07 12.06,53.34 CON_TLC_2.12
T2_13
  Bottom 0.3: U$6.12 13.34,49.53 10.79,52.07 4.45,52.07 3.81,51.44 CON_TLC_2.13
T2_14
  Bottom 0.3: CON_TLC_2.14 9.53,50.8 13.34,46.99 U$6.13
T2_15
  Bottom 0.3: U$6.14 6.99,44.45 3.81,47.62 CON_TLC_2.15
T2_16
  Bottom 0.3: U$6.15 16.51,44.45 15.24,45.72 8.89,45.72 CON_TLC_2.16
T3_1
  Bottom 0.3: U$7.28 16.51,35.56 15.24,36.83 12.7,36.83 8.89,33.02 4.45,33.02 3.81,32.38 CON_TLC_3.1
T3_2
  Bottom 0.3: U$7.1 13.34,35.56 9.53,31.75 CON_TLC_3.2
T3_3
  Bottom 0.3: U$7.2 13.34,33.02 10.79,30.48 4.45,30.48 3.81,29.84 CON_TLC_3.3
T3_4
  Bottom 0.3: U$7.3 13.34,30.48 12.06,29.21 CON_TLC_3.4
T3_5
  Bottom 0.3: U$7.4 4.45,27.94 3.81,27.3 CON_TLC_3.5
T3_6
  Bottom 0.3: U$7.5 13.34,25.4 12.06,26.67 CON_TLC_3.6
T3_7
  Bottom 0.3: CON_TLC_3.7 3.81,24.77 4.45,25.4 10.79,25.4 13.34,22.86 U$7.6
T3_8
  Bottom 0.3: U$7.7 13.34,20.32 9.53,24.13 CON_TLC_3.8
T3_9
  Bottom 0.3: U$7.8 13.34,17.78 8.26,22.86 4.45,22.86 3.81,22.23 CON_TLC_3.9
T3_10
  Bottom 0.3: U$7.9 13.34,15.24 6.99,21.59 CON_TLC_3.10
T3_11
  Bottom 0.3: U$7.10 13.34,12.7 11.43,14.61 11.43,15.88 6.99,20.32 4.45,20.32 3.81,19.68 CON_TLC_3.11
T3_12
  Bottom 0.3: U$7.11 13.34,10.16 10.16,13.34 10.16,15.88 6.99,19.05 CON_TLC_3.12
T3_13
  Bottom 0.3: U$7.12 13.34,7.62 8.89,12.06 8.89,15.88 6.99,17.78 4.45,17.78 3.81,17.14 CON_TLC_3.13
T3_14
  Bottom 0.3: U$7.13 13.34,5.08 7.62,10.79 7.62,15.88 6.99,16.51 CON_TLC_3.14
T3_15
  Bottom 0.3: U$7.14 12.7,2.54 3.81,11.43 CON_TLC_3.15
T3_16
  Bottom 0.3: U$7.15 16.51,2.54 15.24,3.81 12.7,3.81 6.35,10.16 CON_TLC_3.16
T4_1
  Top 0.3: U$1.28 44.45,35.56 43.18,34.29 38.1,34.29 36.83,33.02 33.02,33.02 32.38,32.38 CON_TLC_4.1
T4_2
  Bottom 0.3: U$1.1 41.27,35.56 37.47,31.75 CON_TLC_4.2
T4_3
  Bottom 0.3: U$1.2 41.27,33.02 38.73,30.48 33.02,30.48 32.38,29.84 CON_TLC_4.3
T4_4
  Bottom 0.3: U$1.3 41.27,30.48 40.01,29.21 CON_TLC_4.4
T4_5
  Bottom 0.3: U$1.4 33.02,27.94 32.38,27.3 CON_TLC_4.5
T4_6
  Bottom 0.3: U$1.5 41.27,25.4 40.01,26.67 CON_TLC_4.6
T4_7
  Bottom 0.3: U$1.6 41.27,22.86 38.73,25.4 33.02,25.4 32.38,24.77 CON_TLC_4.7
T4_8
  Bottom 0.3: U$1.7 41.27,20.32 37.47,24.13 CON_TLC_4.8
T4_9
  Bottom 0.3: U$1.8 41.27,17.78 36.2,22.86 33.02,22.86 32.38,22.23 CON_TLC_4.9
T4_10
  Bottom 0.3: U$1.9 35.56,21.59 CON_TLC_4.10
T4_11
  Bottom 0.3: U$1.10 41.27,12.7 40.01,13.97 40.01,15.88 35.56,20.32 33.02,20.32 32.38,19.68 CON_TLC_4.11
T4_12
  Bottom 0.3: U$1.11 41.27,10.16 38.73,12.7 38.73,15.88 35.56,19.05 CON_TLC_4.12
T4_13
  Bottom 0.3: CON_TLC_4.13 32.38,17.14 33.02,17.78 35.56,17.78 37.47,15.88 37.47,11.43 41.27,7.62 U$1.12
T4_14
  Bottom 0.3: CON_TLC_4.14 36.2,15.24 36.2,10.16 41.27,5.08 U$1.13
T4_15
  Bottom 0.3: U$1.14 40.64,2.54 32.38,10.79 CON_TLC_4.15
T4_16
  Bottom 0.3: U$1.15 44.45,2.54 43.18,3.81 40.64,3.81 34.92,9.53 CON_TLC_4.16
TX
  Bottom 0.3: IC1.3 69.22,39.37 69.85,40.01 69.85,71.75 68.58,73.03 60.33,73.03 59.69,73.66 JP1.2

### Text on the board
tNames: - | + | TX | BACK | CAT2 | CAT1 | RGB Connect v1.0.1 | Licensed under the TAPR | Julian Iseringhausen | Open Hardware License | Copyright 2012 | www.tapr.org/OHL | + | - | CAT3 | CAT4 | + | + | + | -